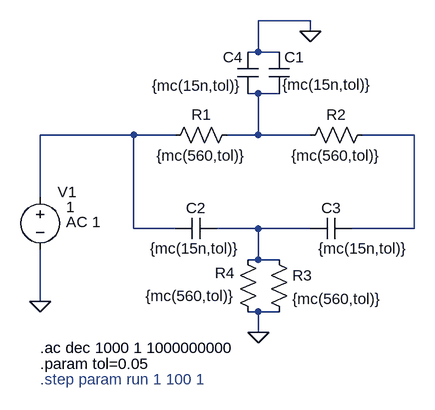
[diagram p0: schematic Twin-T-Notch.asc]
Twin-T-Notch.asc, the LTspice schematic file:
Version 4
SHEET 1 880 680
WIRE 224 -80 144 -80
WIRE 224 -64 224 -80
WIRE 144 -32 144 -80
WIRE 144 -32 128 -32
WIRE 176 -32 144 -32
WIRE 144 32 128 32
WIRE 176 32 144 32
WIRE -48 96 -192 96
WIRE 16 96 -48 96
WIRE 144 96 144 32
WIRE 144 96 96 96
WIRE 224 96 144 96
WIRE 384 96 304 96
WIRE -192 192 -192 96
WIRE -48 240 -48 96
WIRE 16 240 -48 240
WIRE 144 240 80 240
WIRE 224 240 144 240
WIRE 384 240 384 96
WIRE 384 240 288 240
WIRE 144 288 144 240
WIRE 144 288 128 288
WIRE 176 288 144 288
WIRE -192 352 -192 272
WIRE 144 368 128 368
WIRE 176 368 144 368
WIRE 144 400 144 368
FLAG 144 400 0
FLAG 224 -64 0
FLAG -192 352 0
SYMBOL res 112 80 R90
WINDOW 0 0 56 VBottom 2
WINDOW 3 32 56 VTop 2
SYMATTR InstName R1
SYMATTR Value {mc(560,tol)}
SYMATTR SpiceLine tol=1 pwr=0.1
SYMBOL res 320 80 R90
WINDOW 0 0 56 VBottom 2
WINDOW 3 32 56 VTop 2
SYMATTR InstName R2
SYMATTR Value {mc(560,tol)}
SYMATTR SpiceLine tol=1 pwr=0.1
SYMBOL cap 160 -32 R0
WINDOW 3 21 50 Left 2
SYMATTR Value {mc(15n,tol)}
SYMATTR InstName C1
SYMATTR SpiceLine V=25 Irms=0 Rser=0 Lser=0 mfg="Murata" pn="GRM0335C1E300JA01" type="C0G"
SYMBOL cap 80 224 R90
WINDOW 0 0 32 VBottom 2
WINDOW 3 31 34 VTop 2
SYMATTR InstName C2
SYMATTR Value {mc(15n,tol)}
SYMATTR SpiceLine V=10 Irms=0 Rser=0.3882 Lser=317p
SYMBOL cap 288 224 R90
WINDOW 0 0 32 VBottom 2
WINDOW 3 31 -17 VTop 2
SYMATTR InstName C3
SYMATTR Value {mc(15n,tol)}
SYMATTR SpiceLine V=10 Irms=0 Rser=0.3882 Lser=317p
SYMBOL res 160 272 R0
SYMATTR InstName R3
SYMATTR Value {mc(560,tol)}
SYMATTR SpiceLine tol=1 pwr=0.1
SYMBOL voltage -192 176 R0
WINDOW 3 40 31 Left 2
WINDOW 123 40 54 Left 2
WINDOW 39 0 0 Left 0
WINDOW 0 27 8 Left 2
SYMATTR Value 1
SYMATTR Value2 AC 1
SYMATTR InstName V1
SYMBOL res 144 384 R180
WINDOW 0 36 76 Left 2
WINDOW 3 36 40 Left 2
SYMATTR InstName R4
SYMATTR Value {mc(560,tol)}
SYMATTR SpiceLine tol=1 pwr=0.1
SYMBOL cap 144 32 R180
WINDOW 0 24 56 Left 2
WINDOW 3 26 12 Left 2
SYMATTR InstName C4
SYMATTR Value {mc(15n,tol)}
SYMATTR SpiceLine V=10 Irms=0 Rser=0.3882 Lser=317p
TEXT -192 424 Left 2 !.ac dec 1000 1 1000000000
TEXT -192 448 Left 2 !.param tol=0.05
TEXT -192 472 Left 2 ;.step param run 1 100 1

The netlist it stands for:
* Twin-T-Notch.asc
R1 N001 N002 {mc(560,tol)} tol=1 pwr=0.1
R2 N003 N001 {mc(560,tol)} tol=1 pwr=0.1
C1 0 N001 {mc(15n,tol)} V=25 Irms=0 Rser=0 Lser=0 mfg="Murata" pn="GRM0335C1E300JA01" type="C0G"
C2 N004 N002 {mc(15n,tol)} V=10 Irms=0 Rser=0.3882 Lser=317p
C3 N003 N004 {mc(15n,tol)} V=10 Irms=0 Rser=0.3882 Lser=317p
R3 N004 0 {mc(560,tol)} tol=1 pwr=0.1
V1 N002 0 1 AC 1
R4 0 N004 {mc(560,tol)} tol=1 pwr=0.1
C4 N001 0 {mc(15n,tol)} V=10 Irms=0 Rser=0.3882 Lser=317p
.ac dec 1000 1 1000000000
.param tol=0.05
* .step param run 1 100 1
.backanno
.end